# EAGLE design KnivesDualLoopingARFG (EAGLE 9.6.2)
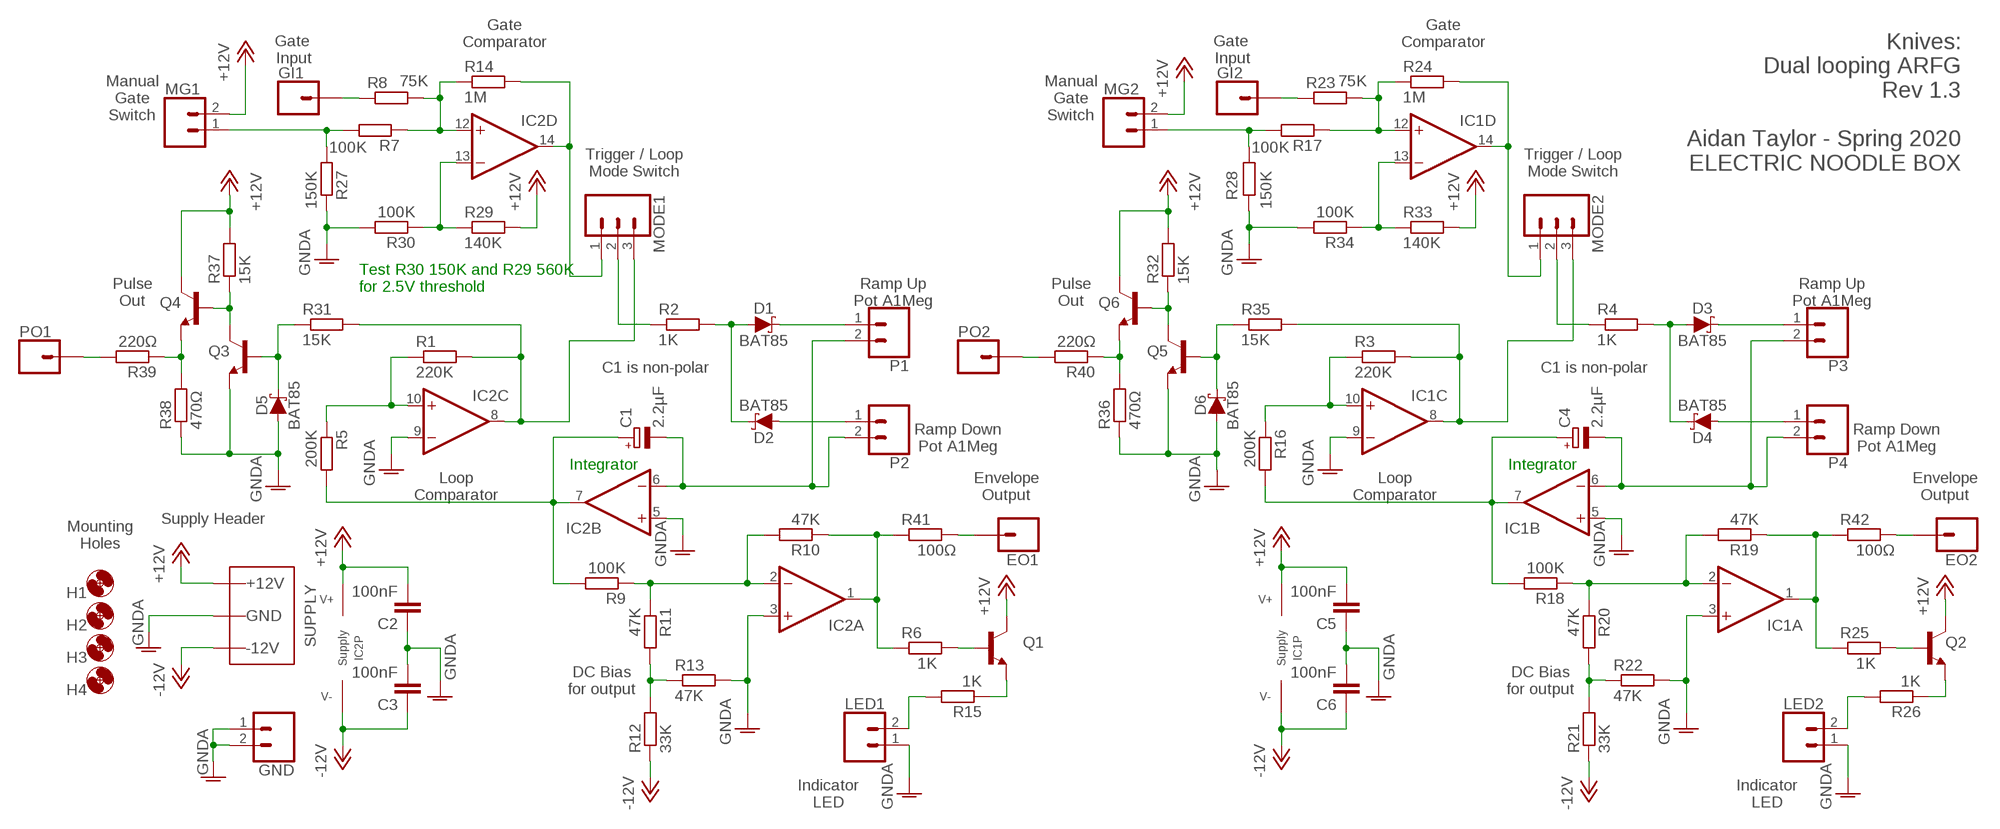
[diagram p0: schematic, sheet 1]

## Parts
C1  2.2µF  CPOL-EUE2-5  [E2-5]
C2  100nF  C-EU050-025X075  [C050-025X075]
C3  100nF  C-EU050-025X075  [C050-025X075]
C4  2.2µF  CPOL-EUE2-5  [E2-5]
C5  100nF  C-EU050-025X075  [C050-025X075]
C6  100nF  C-EU050-025X075  [C050-025X075]
D1  BAT85  SCHOTTKY_DO35  [DO35-7]
D2  BAT85  SCHOTTKY_DO35  [DO35-7]
D3  BAT85  SCHOTTKY_DO35  [DO35-7]
D4  BAT85  SCHOTTKY_DO35  [DO35-7]
D5  BAT85  SCHOTTKY_DO35  [DO35-7]
D6  BAT85  SCHOTTKY_DO35  [DO35-7]
EO1  1XWIREPAD  [1X01]
EO2  1XWIREPAD  [1X01]
GI1  1XWIREPAD  [1X01]
GI2  1XWIREPAD  [1X01]
GND  2XWIREPAD  [1X02]
H1  MOUNT-HOLE3.2  [3,2]
H2  MOUNT-HOLE3.2  [3,2]
H3  MOUNT-HOLE3.2  [3,2]
H4  MOUNT-HOLE3.2  [3,2]
IC1  TL0X4DIL  [DIL14]
IC2  TL0X4DIL  [DIL14]
LED1  2XWIREPAD  [1X02]
LED2  2XWIREPAD  [1X02]
MG1  2XWIREPAD  [1X02]
MG2  2XWIREPAD  [1X02]
MODE1  3XWIREPAD  [1X03]
MODE2  3XWIREPAD  [1X03]
P1  2XWIREPAD  [1X02]
P2  2XWIREPAD  [1X02]
P3  2XWIREPAD  [1X02]
P4  2XWIREPAD  [1X02]
PO1  1XWIREPAD  [1X01]
PO2  1XWIREPAD  [1X01]
Q1  2N3904  [TO92]
Q2  2N3904  [TO92]
Q3  2N3904  [TO92]
Q4  2N3904  [TO92]
Q5  2N3904  [TO92]
Q6  2N3904  [TO92]
R1  220K  R-EU_0207/10  [0207/10]
R2  1K  R-EU_0207/10  [0207/10]
R3  220K  R-EU_0207/10  [0207/10]
R4  1K  R-EU_0207/10  [0207/10]
R5  200K  R-EU_0207/10  [0207/10]
R6  1K  R-EU_0207/10  [0207/10]
R7  100K  R-EU_0207/10  [0207/10]
R8  75K  R-EU_0207/10  [0207/10]
R9  100K  R-EU_0207/10  [0207/10]
R10  47K  R-EU_0207/10  [0207/10]
R11  47K  R-EU_0207/10  [0207/10]
R12  33K  R-EU_0207/10  [0207/10]
R13  47K  R-EU_0207/10  [0207/10]
R14  1M  R-EU_0207/10  [0207/10]
R15  1K  R-EU_0207/10  [0207/10]
R16  200K  R-EU_0207/10  [0207/10]
R17  100K  R-EU_0207/10  [0207/10]
R18  100K  R-EU_0207/10  [0207/10]
R19  47K  R-EU_0207/10  [0207/10]
R20  47K  R-EU_0207/10  [0207/10]
R21  33K  R-EU_0207/10  [0207/10]
R22  47K  R-EU_0207/10  [0207/10]
R23  75K  R-EU_0207/10  [0207/10]
R24  1M  R-EU_0207/10  [0207/10]
R25  1K  R-EU_0207/10  [0207/10]
R26  1K  R-EU_0207/10  [0207/10]
R27  150K  R-EU_0207/10  [0207/10]
R28  150K  R-EU_0207/10  [0207/10]
R29  140K  R-EU_0207/10  [0207/10]
R30  100K  R-EU_0207/10  [0207/10]
R31  15K  R-EU_0207/10  [0207/10]
R32  15K  R-EU_0207/10  [0207/10]
R33  140K  R-EU_0207/10  [0207/10]
R34  100K  R-EU_0207/10  [0207/10]
R35  15K  R-EU_0207/10  [0207/10]
R36  470Ω  R-EU_0207/10  [0207/10]
R37  15K  R-EU_0207/10  [0207/10]
R38  470Ω  R-EU_0207/10  [0207/10]
R39  220Ω  R-EU_0207/10  [0207/10]
R40  220Ω  R-EU_0207/10  [0207/10]
R41  100Ω  R-EU_0207/10  [0207/10]
R42  100Ω  R-EU_0207/10  [0207/10]
WP1  COMBO_SUPPLY_HEADER  [COMBINED_POWER]

## Nets
+12V: C2.2 C5.2 IC1.4(P:V+) IC2.4(P:V+) MG1.2 MG2.2 Q1.1(C) Q2.1(C) Q4.1(C) Q6.1(C) R29.2 R32.2 R33.2 R37.2 WP1.V+1(V++) WP1.V+2(V++) WP1.V+3(V++)
-12V: C3.1 C6.1 IC1.11(P:V-) IC2.11(P:V-) R12.1 R21.1 WP1.V-1(V--) WP1.V-2(V--) WP1.V-3(V--)
ENV1_TRIG: GI1.1 R8.1
ENV1_TRIG1: GI2.1 R23.1
ENVELOPE_OUTPUT: IC2.1(A:OUT) R6.1 R10.1 R41.1
ENVELOPE_OUTPUT1: IC1.1(A:OUT) R19.1 R25.1 R42.1
GNDA: C2.1 C3.2 C5.1 C6.2 D5.A D6.A GND.1 GND.2 IC1.3(A:+IN) IC1.5(B:+IN) IC1.9(C:-IN) IC2.3(A:+IN) IC2.5(B:+IN) IC2.9(C:-IN) LED1.1 LED2.1 Q3.3(E) Q5.3(E) R13.2 R22.2 R27.2 R28.2 R30.2 R34.2 R36.1 R38.1 WP1.GND1(AGND) WP1.GND2(AGND) WP1.GND3(AGND) WP1.GND4(AGND) WP1.GND5(AGND) WP1.GND6(AGND) WP1.GND7(AGND) WP1.GND8(AGND)
N$1: Q5.1(C) Q6.2(B) R32.1
N$2: D1.A D2.C R2.2
N$3: D1.C P1.1
N$4: D2.A P2.1
N$5: C1.- IC2.6(B:-IN) P1.2 P2.2
N$6: Q1.2(B) R6.2
N$7: C1.+ IC2.7(B:OUT) R5.2 R9.2
N$8: IC2.10(C:+IN) R1.1 R5.1
N$9: IC2.2(A:-IN) R9.1 R10.2 R11.1
N$10: Q1.3(E) R15.1
N$11: R11.2 R12.2 R13.1
N$12: MG1.1 R7.2 R27.1
N$13: IC2.12(D:+IN) R7.1 R8.2 R14.1
N$14: MODE1.2 R2.1
N$15: IC2.14(D:OUT) MODE1.1 R14.2
N$16: LED1.2 R15.2
N$17: IC1.8(C:OUT) MODE2.3 R3.2 R35.2
N$18: D3.A D4.C R4.2
N$19: D4.A P4.1
N$20: C4.- IC1.6(B:-IN) P3.2 P4.2
N$21: C4.+ IC1.7(B:OUT) R16.2 R18.2
N$22: IC1.10(C:+IN) R3.1 R16.1
N$23: IC1.2(A:-IN) R18.1 R19.2 R20.1
N$24: R20.2 R21.2 R22.1
N$25: MG2.1 R17.2 R28.1
N$26: IC1.12(D:+IN) R17.1 R23.2 R24.1
N$27: IC1.14(D:OUT) MODE2.1 R24.2
N$28: MODE2.2 R4.1
N$29: Q2.2(B) R25.2
N$30: Q2.3(E) R26.1
N$31: LED2.2 R26.2
N$32: D3.C P3.1
N$33: IC2.13(D:-IN) R29.1 R30.1
N$34: D5.C Q3.2(B) R31.1
N$35: IC1.13(D:-IN) R33.1 R34.1
N$36: D6.C Q5.2(B) R35.1
N$37: Q3.1(C) Q4.2(B) R37.1
N$38: Q4.3(E) R38.2 R39.1
N$39: IC2.8(C:OUT) MODE1.3 R1.2 R31.2
N$40: Q6.3(E) R36.2 R40.1
N$41: PO1.1 R39.2
N$42: PO2.1 R40.2
N$43: EO1.1 R41.2
N$44: EO2.1 R42.2

## Notes on the sheet
- Gate
  Comparator
- Gate
  Comparator
- Knives:
  Dual looping ARFG
  Rev 1.3
  
  Aidan Taylor - Spring 2020
  ELECTRIC NOODLE BOX
- Gate 
  Input
- Gate 
  Input
- Manual
  Gate
  Switch
- Manual
  Gate
  Switch
- Trigger / Loop
  Mode Switch
- Trigger / Loop
  Mode Switch
- Pulse
  Out
- Test R30 150K and R29 560K
  for 2.5V threshold
- Ramp Up
  Pot A1Meg
- Pulse
  Out
- Ramp Up
  Pot A1Meg
- C1 is non-polar | C1 is non-polar
- Ramp Down
  Pot A1Meg
- Ramp Down
  Pot A1Meg
- Integrator | Integrator
- Loop
  Comparator
- Envelope
  Output
- Loop
  Comparator
- Envelope
  Output
- Supply Header
- Mounting
  Holes
- DC Bias
  for output
- DC Bias
  for output
- Indicator
  LED
- Indicator
  LED

## Library data of the parts
C1 C4 = rcl:CPOL-EU: POLARIZED CAPACITOR, European symbol; SPICEPREFIX: C
C2 C3 C5 C6 = rcl:C-EU: CAPACITOR, European symbol; SPICEPREFIX: C
D1-D6 = ElectricNoodleBox:SCHOTTKY_DO35
EO1 EO2 GI1 GI2 PO1 PO2 = ElectricNoodleBox:1XWIREPAD
GND LED1 LED2 MG1 MG2 P1-P4 = ElectricNoodleBox:2XWIREPAD
H1-H4 = holes:MOUNT-HOLE: MOUNTING HOLE with drill center marker
IC1 IC2 = ElectricNoodleBox:TL0X4
MODE1 MODE2 = ElectricNoodleBox:3XWIREPAD
Q1-Q6 = transistor:2N3904: NPN TRANSISTOR
R1-R42 = rcl:R-EU_: RESISTOR, European symbol; SPICEPREFIX: R
WP1 = ElectricNoodleBox:COMBO_SUPPLY_HEADER

## Board
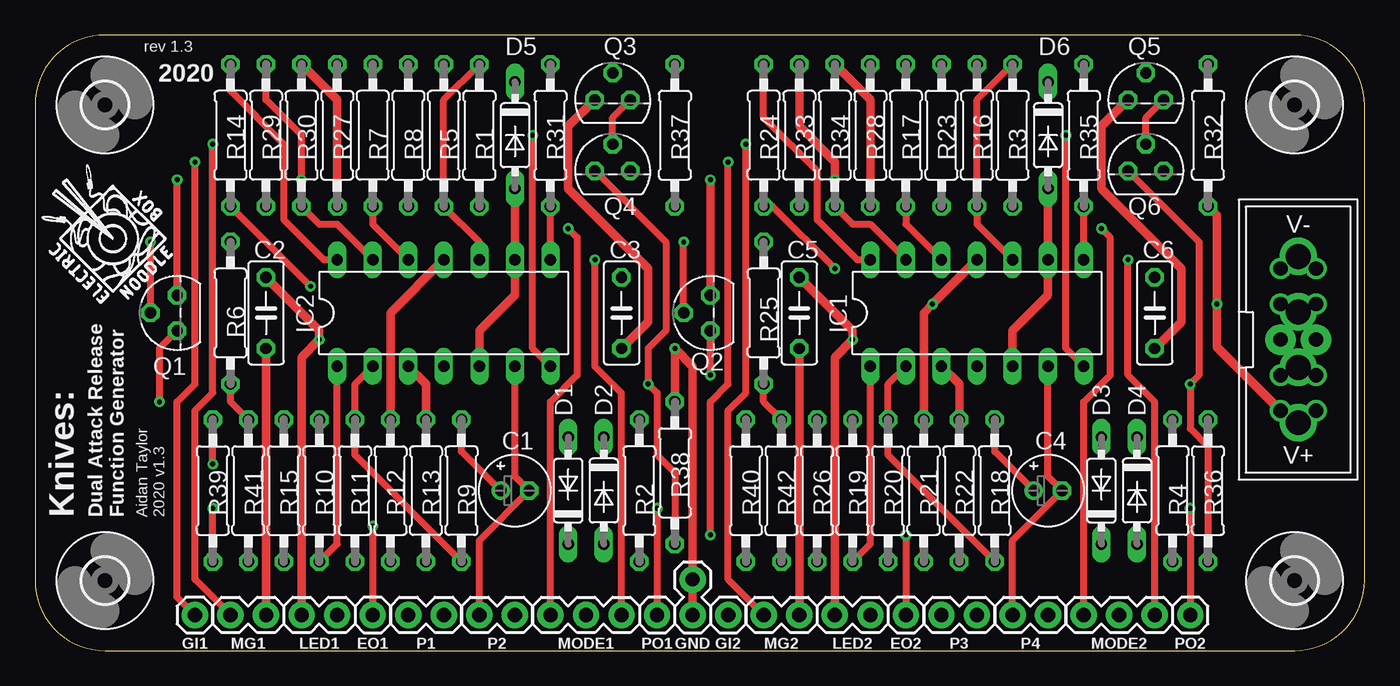
[diagram p1: board, top side]
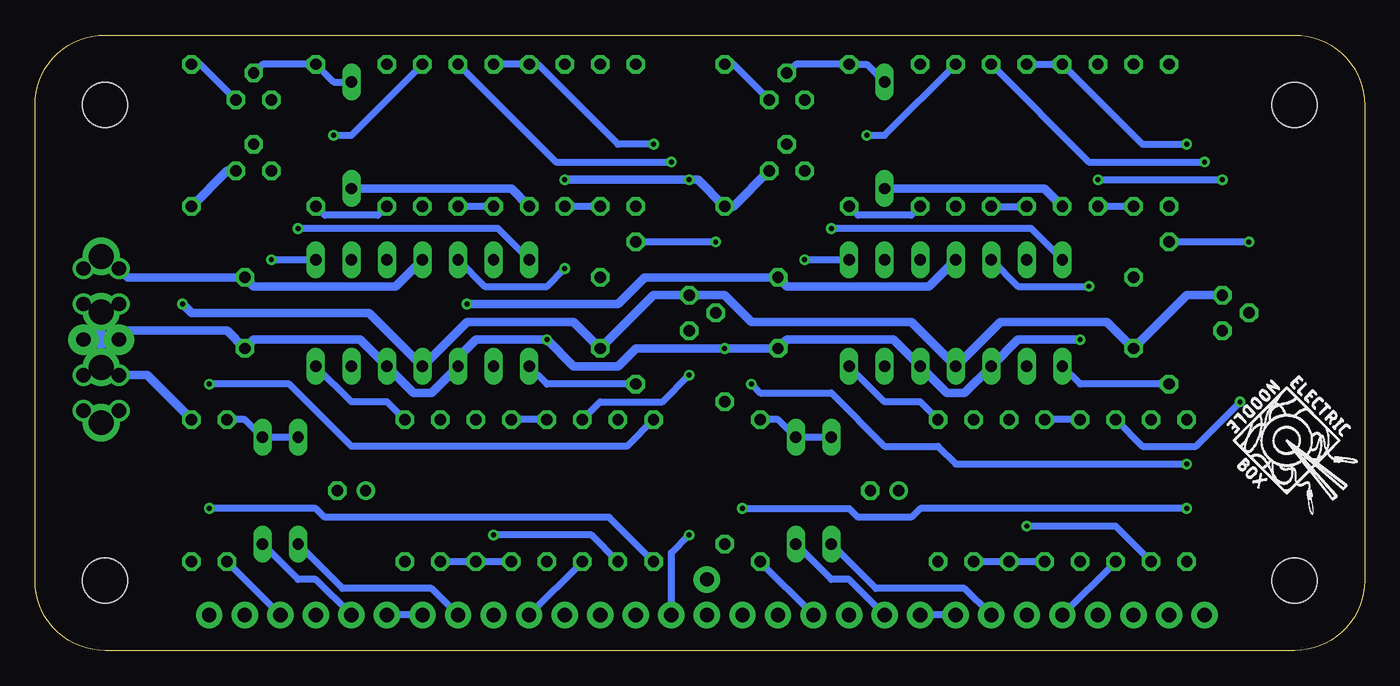
[diagram p2: board, bottom side, seen from below]

Size 95 x 44 mm. Coordinates in mm from the lower left corner, seen from the top.
Outline: 0,39 0,5 arc90 5,0 90,0 arc90 95,5 95,39 arc90 90,44 5,44 arc90 0,39
Copper layers (1*16): Top 0.035mm / dielectric 1.5mm / Bottom 0.035mm
Design rules "default": minimum track width 6mil, minimum drill 0.35mm, track to track 6mil, track to pad 6mil, pad to pad 6mil, via to via 6mil, smd to smd 6mil, copper to edge 40mil, drill to drill 6mil, minimum pad ring 10mil, minimum via ring 8mil, stop-mask expansion 4mil, vias tented up to drill 0mil, thermal gap 10mil

### Footprints (pad centres in the part's own frame; a part is rotated, then mirrored left to right if it is on the bottom)
E2-5 = drill 0.813 pad 1.27: + -1.016,0 | drill 0.813 pad 1.27 octagon: - 1.016,0
C050-025X075 = drill 0.813 octagon: 1 -2.54,0; 2 2.54,0
DO35-7 = drill 0.813 long: A 3.81,0; C -3.81,0
1X01 = drill 1.016 pad 1.88: 1 0,0
1X02 = drill 1.016 pad 1.88: 1 0,0; 2 2.54,0
3,2 = hole 3.2: 0,0
DIL14 = drill 0.813 long: 1 -7.62,-3.81; 2 -5.08,-3.81; 3 -2.54,-3.81; 4 0,-3.81; 5 2.54,-3.81; 6 5.08,-3.81; 7 7.62,-3.81; 8 7.62,3.81; 9 5.08,3.81; 10 2.54,3.81; 11 0,3.81; 12 -2.54,3.81; 13 -5.08,3.81; 14 -7.62,3.81
1X03 = drill 1.016 pad 1.88: 1 0,0; 2 2.54,0; 3 5.08,0
TO92 = drill 0.813 octagon: 1 1.27,0; 2 0,1.905; 3 -1.27,0
0207/10 = drill 0.813 octagon: 1 -5.08,0; 2 5.08,0
COMBINED_POWER = drill 1.78: GND1 -1.98,0; GND2 1.98,0; V+1 -5.94,0; V-1 5.94,0 | drill 1.016: GND3 -2.54,1.27; GND5 2.54,1.27; GND6 -2.54,-1.27; GND8 2.54,-1.27; V+2 -5.08,1.27; V+3 -5.08,-1.27; V-2 5.08,1.27; V-3 5.08,-1.27 | drill 1.016 pad 2.184: GND4 0,1.27; GND7 0,-1.27

### Placement (x,y rotation side)
C1  34.29,11.43 0 top
C2  16.51,24.13 270 top
C3  41.91,24.13 270 top
C4  72.39,11.43 0 top
C5  54.61,24.13 270 top
C6  80.01,24.13 270 top
D1  38.1,11.43 90 top
D2  40.64,11.43 270 top
D3  76.2,11.43 90 top
D4  78.74,11.43 270 top
D5  34.29,36.83 270 top
D6  72.39,36.83 270 top
EO1  24.13,2.54 270 top
EO2  62.23,2.54 90 top
GI1  11.43,2.54 0 top
GI2  49.53,2.54 90 top
GND  46.99,2.54 90 top
H1  90,5 0 top
H2  90,39 0 top
H3  5,5 0 top
H4  5,39 0 top
IC1  67.31,24.13 0 top
IC2  29.21,24.13 0 top
LED1  19.05,2.54 0 top
LED2  57.15,2.54 0 top
MG1  13.97,2.54 0 top
MG2  52.07,2.54 0 top
MODE1  36.83,2.54 0 top
MODE2  74.93,2.54 0 top
P1  26.67,2.54 0 top
P2  34.29,2.54 180 top
P3  64.77,2.54 0 top
P4  72.39,2.54 180 top
PO1  44.45,2.54 90 top
PO2  82.55,2.54 0 top
Q1  10.16,24.13 90 top
Q2  48.26,24.13 90 top
Q3  41.27,39.37 0 top
Q4  41.27,34.29 0 top
Q5  79.38,39.37 0 top
Q6  79.38,34.29 0 top
R1  31.75,36.83 270 top
R2  43.18,11.43 90 top
R3  69.85,36.83 270 top
R4  81.28,11.43 90 top
R5  29.21,36.83 90 top
R6  13.97,24.13 90 top
R7  24.13,36.83 90 top
R8  26.67,36.83 270 top
R9  30.48,11.43 90 top
R10  20.32,11.43 90 top
R11  22.86,11.43 270 top
R12  25.4,11.43 270 top
R13  27.94,11.43 90 top
R14  13.97,36.83 90 top
R15  17.78,11.43 270 top
R16  67.31,36.83 90 top
R17  62.23,36.83 90 top
R18  68.58,11.43 90 top
R19  58.42,11.43 90 top
R20  60.96,11.43 270 top
R21  63.5,11.43 270 top
R22  66.04,11.43 90 top
R23  64.77,36.83 270 top
R24  52.07,36.83 90 top
R25  52.07,24.13 90 top
R26  55.88,11.43 270 top
R27  21.59,36.83 270 top
R28  59.69,36.83 270 top
R29  16.51,36.83 90 top
R30  19.05,36.83 90 top
R31  36.83,36.83 270 top
R32  83.82,36.83 270 top
R33  54.61,36.83 90 top
R34  57.15,36.83 90 top
R35  74.93,36.83 270 top
R36  83.82,11.43 270 top
R37  45.72,36.83 270 top
R38  45.72,12.7 270 top
R39  12.7,11.43 270 top
R40  50.8,11.43 270 top
R41  15.24,11.43 270 top
R42  53.34,11.43 270 top
U$1  [LOGO10X10]  10.16,24.77 90 top
U$2  [LOGO10X10]  10.16,19.68 270 bottom
WP1  90.27,22.23 90 top

### Tracks (layer width: path | path; a pad name or v marks a point on that pad's centre or on a via)
+12V  (via drill 0.35)
  Top 0.508: Q1.1 v10.16,33.66 | v19.05,33.66 19.05,36.83 16.51,39.37 R29.2
  Top 0.61: MG1.2 C2.2 | MG2.2 C5.2 | Q2.1 v48.26,33.66 | R33.2 54.61,37.47 57.15,34.92 v57.15,33.66 | WP1.V+3 91.12,17.14 WP1.V+1 89.86,16.29 WP1.V+2 84.45,21.68 v84.45,24.77 84.45,31.11 R32.2
  Bottom 0.508: v19.05,33.66 v10.16,33.66
  Bottom 0.61: Q1.1 12.7,25.4 C2.2 18.41,23.5 26.04,23.5 IC2.4 32.38,23.5 43.81,23.5 45.72,25.4 Q2.1 50.8,25.4 C5.2 56.52,23.5 64.14,23.5 IC1.4 71.12,24.13 83.82,24.13 v84.45,24.77 | v57.15,33.66 v48.26,33.66 47.62,33.66 R37.2 45.09,31.75 Q4.1 | Q6.1 81.28,34.29 R32.2
-12V  (via drill 0.35)
  Top 0.61: IC2.11 25.4,24.13 R12.1 | R21.1 63.5,24.13 v64.14,24.77 IC1.11
  Bottom 0.61: IC2.11 31.11,26.04 41.27,26.04 C3.1 51.44,26.67 53.34,24.77 v64.14,24.77 | IC1.11 69.22,26.04 79.38,26.04 C6.1 88.36,26.67 WP1.V-2 89.41,27.3 WP1.V-1 91.12,27.3 WP1.V-3
ENV1_TRIG  (via drill 0.35)
  Top 0.508: GI1.1 10.16,3.81 10.16,17.78 11.43,19.05 v11.43,34.92
  Bottom 0.508: R8.1 19.68,34.92 v11.43,34.92
ENV1_TRIG1  (via drill 0.35)
  Top 0.508: v48.26,8.26 48.26,17.78 49.53,19.05 v49.53,34.92
  Bottom 0.508: R23.1 57.78,34.92 v49.53,34.92 | GI2.1 49.53,6.99 v48.26,8.26
ENVELOPE_OUTPUT
  Top 0.508: R10.1 21.59,7.62 IC2.1 | R41.1 13.97,17.78 R6.1
  Bottom 0.508: R6.1 20.32,19.05 IC2.1
ENVELOPE_OUTPUT1
  Top 0.508: R19.1 59.69,7.62 IC1.1 | R42.1 52.07,17.78 R25.1
  Bottom 0.508: IC1.1 58.42,19.05 R25.1
GNDA  (via drill 0.35)
  Top 0.61: LED1.1 19.05,20.95 v20.32,22.23 20.32,22.86 C2.1 | IC2.3 27.94,19.05 R13.2 | IC2.5 31.75,22.86 34.29,25.4 IC2.9 D5.A | R30.2 21.59,39.37 R27.2 | C3.2 43.81,23.5 43.81,27.3 38.1,33.02 38.1,37.47 Q3.3 | LED2.1 57.15,20.95 v58.42,22.23 58.42,22.86 C5.1 | IC1.3 66.04,19.05 R22.2 | IC1.5 69.85,22.86 72.39,25.4 IC1.9 D6.A | C6.2 81.92,23.5 81.92,27.3 76.2,33.02 76.2,37.47 Q5.3 | R28.2 59.69,39.37 R34.2 | GND.1 GND.2 46.99,20.32 v45.72,21.59 R38.1
  Bottom 0.61: v20.32,22.23 24.77,22.23 IC2.3 28.57,18.41 29.84,18.41 IC2.5 33.66,22.23 41.27,22.23 C3.2 v45.72,21.59 52.07,21.59 53.34,20.32 56.52,20.32 v58.42,22.23 63.5,22.23 64.77,20.95 IC1.3 66.67,18.41 67.94,18.41 IC1.5 71.75,22.23 79.38,22.23 C6.2 81.28,22.86 88.36,22.86 WP1.GND4 WP1.GND7 90.27,23.5 WP1.GND2 | R27.2 22.86,33.02 D5.A | R28.2 60.96,33.02 D6.A | WP1.GND2 89.56,24.2 WP1.GND5 | WP1.GND2 90.97,24.2 WP1.GND8 | WP1.GND1 89.56,20.25 WP1.GND3 87,19.68 R36.1 | WP1.GND1 90.97,20.25 WP1.GND6 | WP1.GND1 WP1.GND2
N$1
  Top 0.508: Q5.1 79.38,38.1 Q6.2
  Bottom 0.508: Q5.1 83.19,41.91 R32.1
N$2
  Bottom 0.508: D1.A D2.C 41.91,16.51 R2.2
N$3
  Bottom 0.508: P1.1 28.57,4.45 34.92,4.45 D1.C
N$4
  Bottom 0.508: P2.1 36.83,5.08 38.1,5.08 D2.A
N$5
  Top 0.508: P2.2 31.75,7.87 C1.- 34.29,12.45 IC2.6
  Bottom 0.508: P1.2 P2.2
N$6  (via drill 0.35)
  Top 0.508: Q1.2 v8.26,29.21
  Bottom 0.508: v8.26,29.21 R6.2
N$7  (via drill 0.35)
  Top 0.508: C1.+ 30.48,14.22 R9.2 | IC2.7 35.56,21.59 v35.56,36.83
  Bottom 0.508: R9.2 31.75,17.78 34.29,17.78 IC2.7 | v35.56,36.83 34.29,36.83 R5.2
N$8
  Top 0.508: IC2.10 31.75,29.21 R5.1 29.21,39.37 R1.1
N$9
  Top 0.508: R9.1 22.86,13.97 R11.1 22.86,19.05 IC2.2
  Bottom 0.508: R10.2 R11.1
N$10  (via drill 0.35)
  Top 0.508: v8.89,17.78 8.89,21.59 Q1.3
  Bottom 0.508: v8.89,17.78 12.06,14.61 15.88,14.61 R15.1
N$11
  Bottom 0.508: R11.2 R12.2 R13.1
N$12  (via drill 0.35)
  Top 0.508: v12.7,36.2 12.7,18.41 11.43,17.14 11.43,5.08 MG1.1
  Bottom 0.508: R7.2 R27.1 15.88,36.2 v12.7,36.2
N$13  (via drill 0.35)
  Top 0.508: v19.68,26.04 R14.1 | IC2.12 24.13,30.48 R7.1
  Bottom 0.508: IC2.12 24.77,26.04 v19.68,26.04 | R8.2 R7.1
N$14
  Bottom 0.508: MODE1.2 R2.1
N$15  (via drill 0.35)
  Top 0.508: MODE1.1 36.83,17.78 38.73,19.68 38.73,29.53 v38.1,30.16 | R14.2 13.97,40.01 17.78,36.2 17.78,30.8 20.64,27.94 IC2.14
  Bottom 0.508: IC2.14 23.81,30.16 v38.1,30.16
N$16
  Bottom 0.508: LED1.2 R15.2
N$17  (via drill 0.35)
  Top 0.508: MODE2.3 80.01,17.78 78.11,19.68 v78.11,27.94 | IC1.8 R35.2
  Bottom 0.508: v78.11,27.94 IC1.8 | R3.2 70.48,31.11 74.3,31.11 R35.2
N$18
  Bottom 0.508: D3.A D4.C 80.01,16.51 R4.2
N$19
  Bottom 0.508: P4.1 74.93,5.08 76.2,5.08 D4.A
N$20
  Top 0.508: P4.2 69.85,7.87 C4.- 72.39,12.45 IC1.6
  Bottom 0.508: P3.2 P4.2
N$21  (via drill 0.35)
  Top 0.508: C4.+ 68.58,14.22 R18.2 | IC1.7 73.66,21.59 v73.66,36.83
  Bottom 0.508: R18.2 69.85,17.78 72.39,17.78 IC1.7 | v73.66,36.83 72.39,36.83 R16.2
N$22
  Top 0.508: IC1.10 67.31,30.48 R16.1 67.31,39.37 R3.1
N$23
  Top 0.508: R18.1 60.96,13.97 R20.1 60.96,19.05 IC1.2
  Bottom 0.508: R19.2 R20.1
N$24
  Bottom 0.508: R20.2 R21.2 R22.1
N$25  (via drill 0.35)
  Top 0.508: v50.8,36.2 50.8,18.41 49.53,17.14 49.53,5.08 MG2.1
  Bottom 0.508: v50.8,36.2 53.34,36.2 59.05,41.91 R28.1 R17.2
N$26  (via drill 0.35)
  Top 0.508: IC1.12 62.23,30.48 R17.1 | v57.15,27.3 52.7,31.75 R24.1
  Bottom 0.508: IC1.12 62.87,26.04 58.42,26.04 v57.15,27.3 | R17.1 R23.2
N$27  (via drill 0.35)
  Top 0.508: MODE2.1 74.93,17.78 76.83,19.68 76.83,29.53 v76.2,30.16 | R24.2 52.07,38.1 55.88,34.29 55.88,30.8 58.74,27.94 IC1.14
  Bottom 0.508: v76.2,30.16 61.91,30.16 IC1.14
N$28
  Bottom 0.508: MODE2.2 R4.1
N$29  (via drill 0.35)
  Top 0.508: Q2.2 v46.35,29.21
  Bottom 0.508: v46.35,29.21 R25.2
N$30  (via drill 0.35)
  Top 0.508: v48.26,19.68 Q2.3
  Bottom 0.508: R26.1 54.61,17.78 50.16,17.78 v48.26,19.68
N$31
  Bottom 0.508: LED2.2 R26.2
N$32
  Bottom 0.508: P3.1 66.67,4.45 73.03,4.45 D3.C
N$33
  Top 0.508: IC2.13 21.59,30.48 20.32,30.48 R30.1
  Bottom 0.508: R29.1 R30.1
N$34
  Bottom 0.508: D5.C 35.56,41.91 R31.1 40.64,41.91 Q3.2
N$35
  Top 0.508: IC1.13 59.69,30.48 58.42,30.48 R34.1
  Bottom 0.508: R33.1 R34.1
N$36
  Bottom 0.508: D6.C 73.66,40.64 R35.1 78.74,41.91 Q5.2
N$37
  Top 0.508: Q3.1 41.27,38.1 Q4.2
  Bottom 0.508: R37.1 45.09,41.91 Q3.1
N$38  (via drill 0.35)
  Top 0.508: Q4.3 45.09,29.21 45.09,22.86 43.81,21.59 v43.81,19.05 44.45,18.41 44.45,13.97 45.72,12.7 R38.2 | v12.7,13.34 R39.1
  Bottom 0.508: v43.81,19.05 43.18,18.41 38.1,18.41 34.29,14.61 30.48,14.61 29.21,13.34 v12.7,13.34
N$39  (via drill 0.35)
  Top 0.508: MODE1.3 41.91,18.41 40.01,20.32 v40.01,27.94 | IC2.8 R31.2
  Bottom 0.508: v40.01,27.94 IC2.8 | R1.2 32.38,31.11 36.2,31.11 R31.2
N$40  (via drill 0.35)
  Top 0.508: Q6.3 83.19,29.21 83.19,19.68 v82.55,19.05 82.55,15.88 83.82,14.61 R36.2
  Bottom 0.508: R40.1 52.7,14.61 72.39,14.61 76.83,19.05 v82.55,19.05
N$41  (via drill 0.35)
  Top 0.508: R39.2 v12.7,10.16 | v44.45,10.16 PO1.1
  Bottom 0.508: v44.45,10.16 36.83,10.16 36.2,9.53 32.38,9.53 31.75,10.16 v12.7,10.16
N$42  (via drill 0.35)
  Top 0.508: v82.55,10.16 PO2.1
  Bottom 0.508: R40.2 53.98,9.53 74.3,9.53 74.93,10.16 v82.55,10.16
N$43  (via drill 0.35)
  Top 0.508: v24.13,8.89 EO1.1
  Bottom 0.508: v24.13,8.89 17.78,8.89 R41.2
N$44  (via drill 0.35)
  Top 0.508: v62.23,8.26 EO2.1
  Bottom 0.508: R42.2 55.24,8.26 v62.23,8.26

### Text on the board
tPlace: rev 1.3 | 2020 | Knives: | Dual Attack Release / Function Generator | Aidan Taylor / 2020 v1.3